# EasyEDA Pro project Connector_FPC_V2025.12.eprj

# Schematic Schematic1
Board Name: Board1; Create Date: 2025-12-14; Page Name: P1; Project Name: Connector_FPC_V2025.12; Schematic Name: Schematic1; Update Date: 2025-12-26; Company: EasyEDA.com; Page Size: A4; Version: V1.0
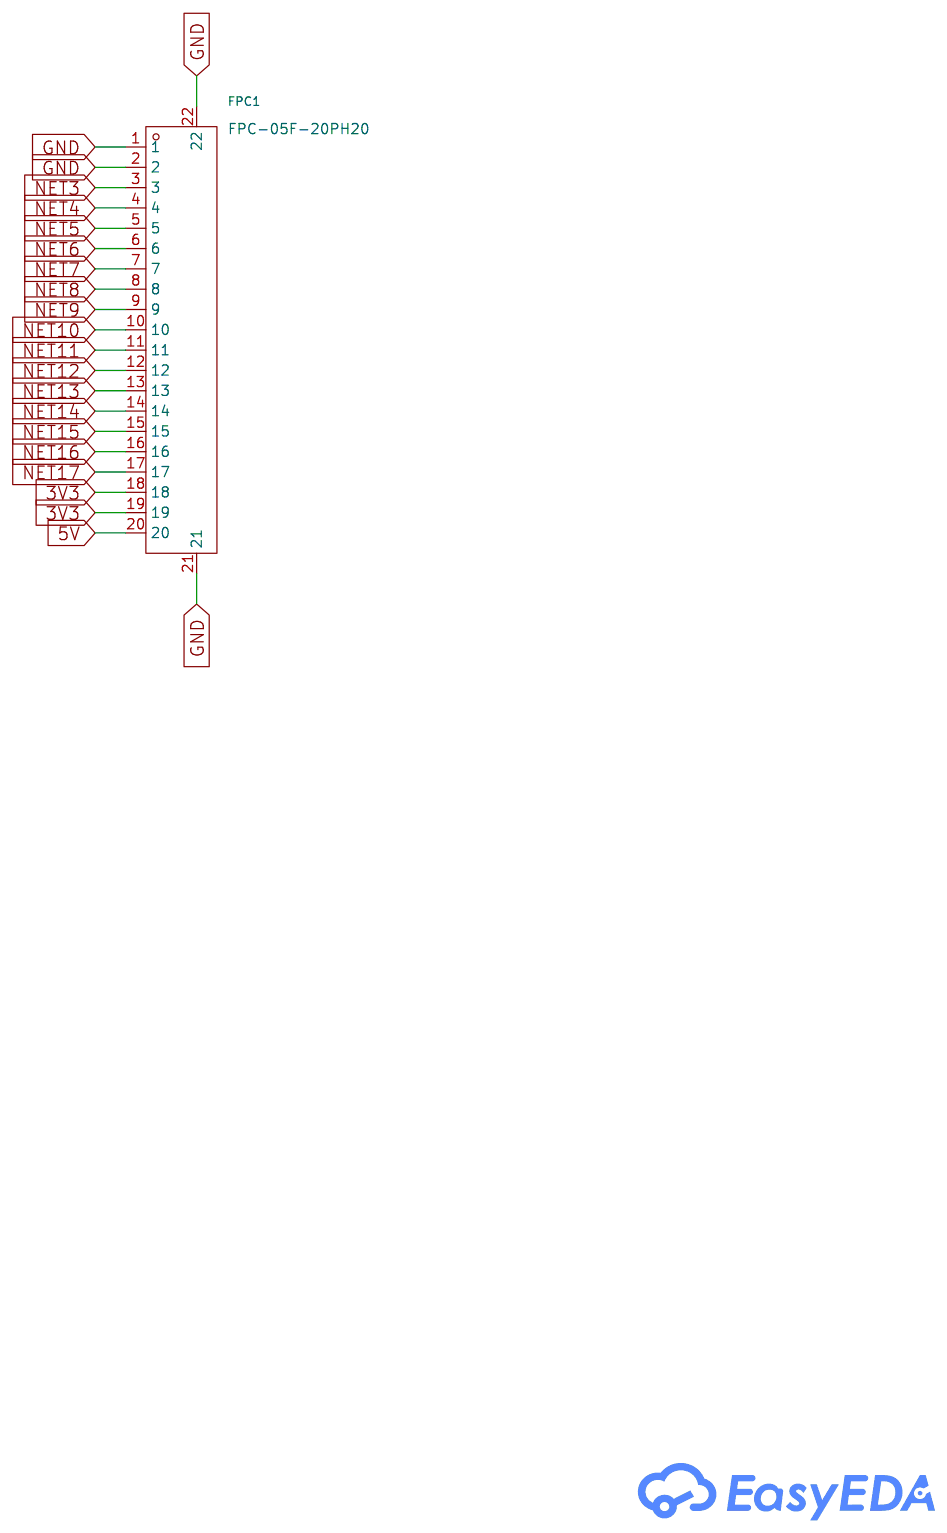
[diagram p0: schematic sheet]

## Parts
FPC1  FPC-05F-20PH20  [FPC-SMD_20P-P0.50_XUNPU_FPC-05F-20PH20]

## Library data of the parts
FPC1 = FPC-05F-20PH20: Locking Feature:Hinged Lid Contact Type:Surface Mount Number of Contacts:20P Pitch:0.5mm Mounting Type:Bottom Contact FFC, FCB Thickness:0.3mm FFC, FCB Thickness:0.3mm Height Above Board:2mm Contact Material:Phosphor Bronze Contact Plating:Tin Operating T; LCSC Part Name: 翻盖式 卧贴 P数:20P 间距:0.5mm; Supplier Part: C2856803; Manufacturer: XUNPU(讯普); Supplier Footprint: SMD,P=0.5mm,卧贴; JLCPCB Part Class: 扩展库; Datasheet: https://item.szlcsc.com/datasheet/FPC-05F-20PH20/3056901.html; Supplier: LCSC; Locking Feature: Hinged Lid; Contact Type: Surface Mount; Number of Contacts: 20P; Pitch: 0.5mm; Mounting Type: Bottom Contact; FFC, FCB Thickness: 0.3mm; Height Above Board: 2mm; Contact Material: Phosphor Bronze; Contact Plating: Tin; Operating Temperature: -25℃~+85℃; Rated Voltage (Max): 50V; Current Rating (Max): 500mA

## Nets
3V3: FPC1.18 FPC1.19
5V: FPC1.20
GND: FPC1.1 FPC1.2 FPC1.21 FPC1.22
NET3: FPC1.3
NET4: FPC1.4
NET5: FPC1.5
NET6: FPC1.6
NET7: FPC1.7
NET8: FPC1.8
NET9: FPC1.9
NET10: FPC1.10
NET11: FPC1.11
NET12: FPC1.12
NET13: FPC1.13
NET14: FPC1.14
NET15: FPC1.15
NET16: FPC1.16
NET17: FPC1.17

# Board PCB1
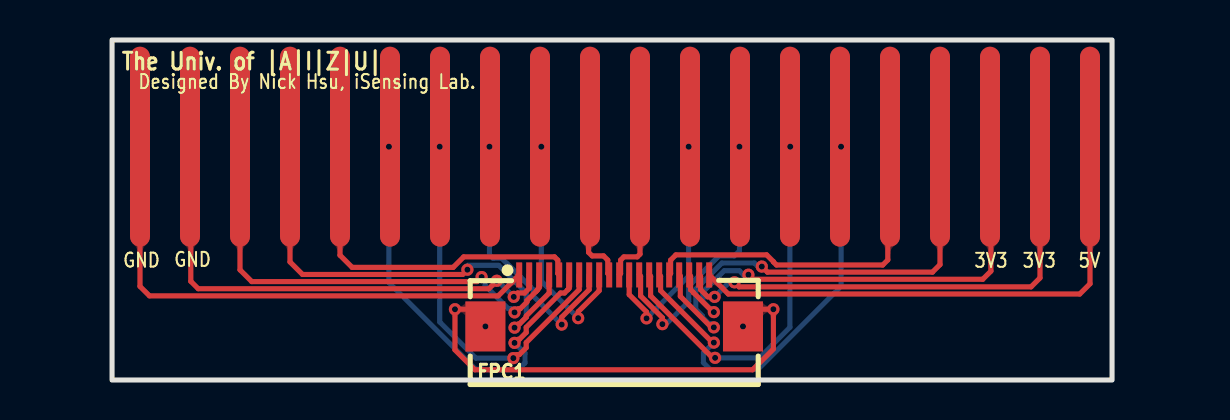
[diagram p1: board, top side]
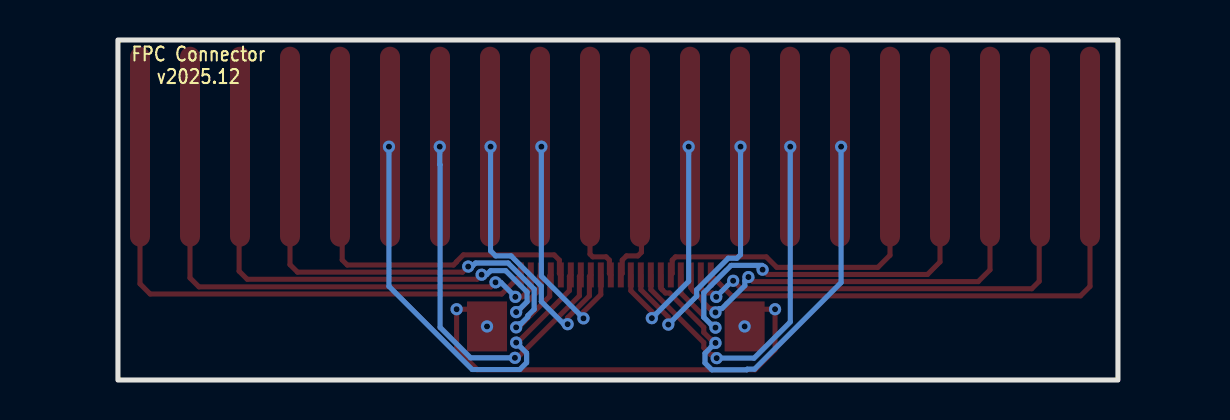
[diagram p2: board, bottom side, seen from below]

Outline 50 x 17 mm; copper layers: Top Layer, Bottom Layer. Coordinates in mm from the lower left corner of the outline.
Outline path: rectangle 0,17 50,0
Stack: Top Layer 0.035mm / Dielectric1 1.51mm FR4 er 4.5 / Bottom Layer 0.035mm

## Design rules (mm)
template: JLCPCB Capability(Two Layers Board)
spacing copperThickness1oz (default): track to track 0.102, other pairs 0.152 to 0.3
spacing copperThickness2oz: track to track 0.203, other pairs 0.152 to 0.3
track width copperThickness1oz (default): min 0.127, default 0.254, max 2.54
track width copperThickness2oz: min 0.203, default 0.254, max 2.54
differential pair differentialPair (default): width min 0.127, default 0.254, max 2.54; gap min 0.152, default 0.152
via viaSize (default): diameter min 0.5, default 0.61, max 10; hole min 0.3, default 0.305, max 6.3

## Placement (name value [footprint] x y rotation side)
FPC1  FPC-05F-20PH20  [FPC-SMD_20P-P0.50_XUNPU_FPC-05F-20PH20]  25.11 3.97 0 top
NOREF  -  [Pad_e6]  8.9 11.67 0 top
NOREF#2  -  [Pad_e3]  41.4 11.67 0 top
NOREF#3  -  [Pad_e4]  3.9 11.67 0 top
NOREF#4  -  [Pad_e21]  48.9 11.67 0 top
NOREF#5  -  [Pad_e18]  43.9 11.67 0 top
NOREF#6  -  [Pad_e17]  36.4 11.67 0 top
NOREF#7  -  [Pad_e12]  23.9 11.67 0 top
NOREF#8  -  [Pad_e15]  31.4 11.67 0 top
NOREF#9  -  [Pad_e14]  28.9 11.67 0 top
NOREF#10  -  [Pad_e10]  18.9 11.67 0 top
NOREF#11  -  [Pad_e8]  13.9 11.67 0 top
NOREF#12  -  [Pad_e7]  11.4 11.67 0 top
NOREF#13  -  [Pad_e1]  1.4 11.67 0 top
NOREF#14  -  [Pad_e11]  21.4 11.67 0 top
NOREF#15  -  [Pad_e13]  26.4 11.67 0 top
NOREF#16  -  [Pad_e2]  38.9 11.67 0 top
NOREF#17  -  [Pad_e16]  33.9 11.67 0 top
NOREF#18  -  [Pad_e19]  46.4 11.67 0 top
NOREF#19  -  [Pad_e5]  6.4 11.67 0 top
NOREF#20  -  [Pad_e9]  16.4 11.67 0 top

## Footprints (pads in the part's own frame, mm; a bottom-side part is the same pattern mirrored in y, then rotated)
FPC-SMD_20P-P0.50_XUNPU_FPC-05F-20PH20
  rect 0.3x1.25 smd: 1(-4.75,1.288) 2(-4.25,1.288) 3(-3.75,1.288) 4(-3.25,1.288) 5(-2.75,1.288) 6(-2.25,1.288) 7(-1.75,1.288) 8(-1.25,1.288) 9(-0.75,1.288) 10(-0.25,1.288) 11(0.25,1.288) 12(0.75,1.288) 13(1.25,1.288) 14(1.75,1.288) 15(2.25,1.288) 16(2.75,1.288) 17(3.25,1.288) 18(3.75,1.288) 19(4.25,1.288) 20(4.75,1.288)
  rect 2x2.5 smd: 21(6.44,-1.288) 22(-6.44,-1.288)
Pad_e1
  rrect 1x10 smd: 1(0,0)
Pad_e2
  rrect 1x10 smd: 15(0,0)
Pad_e3
  rrect 1x10 smd: 15(0,0)
Pad_e4
  rrect 1x10 smd: 2(0,0)
Pad_e5
  rrect 1x10 smd: 3(0,0)
Pad_e6
  rrect 1x10 smd: 4(0,0)
Pad_e7
  rrect 1x10 smd: 5(0,0)
Pad_e8
  rrect 1x10 smd: 6(0,0)
Pad_e9
  rrect 1x10 smd: 7(0,0)
Pad_e10
  rrect 1x10 smd: 8(0,0)
Pad_e11
  rrect 1x10 smd: 9(0,0)
Pad_e12
  rrect 1x10 smd: 10(0,0)
Pad_e13
  rrect 1x10 smd: 11(0,0)
Pad_e14
  rrect 1x10 smd: 12(0,0)
Pad_e15
  rrect 1x10 smd: 13(0,0)
Pad_e16
  rrect 1x10 smd: 14(0,0)
Pad_e17
  rrect 1x10 smd: 15(0,0)
Pad_e18
  rrect 1x10 smd: 15(0,0)
Pad_e19
  rrect 1x10 smd: 15(0,0)
Pad_e21
  rrect 1x10 smd: 15(0,0)

## Nets
3V3: FPC1.18 FPC1.19 NOREF#5.15 NOREF#18.15
5V: FPC1.20 NOREF#4.15
GND: FPC1.1 FPC1.2 FPC1.21 FPC1.22 NOREF#3.2 NOREF#13.1
NET3: FPC1.3 NOREF#19.3
NET4: FPC1.4 NOREF.4
NET5: FPC1.5 NOREF#12.5
NET6: FPC1.6 NOREF#11.6
NET7: FPC1.7 NOREF#20.7
NET8: FPC1.8 NOREF#10.8
NET9: FPC1.9 NOREF#14.9
NET10: FPC1.10 NOREF#7.10
NET11: FPC1.11 NOREF#15.11
NET12: FPC1.12 NOREF#9.12
NET13: FPC1.13 NOREF#8.13
NET14: FPC1.14 NOREF#17.14
NET15: FPC1.15 NOREF#6.15
NET16: FPC1.16 NOREF#16.15
NET17: FPC1.17 NOREF#2.15

## Via types
v1: diameter 0.61, hole 0.305, Top Layer to Bottom Layer, 32 vias

## Routing (per net, layer and track width the routed paths; a pad name or vN(x,y) marks a point on that pad's centre or on a via; arc(x,y) is an arc through that point)
3V3: length 50.1
  Top Layer w0.254: v1(30.13,4.16) 29.78,4.16 29.43,4.51 29.43,5.18 FPC1.19 ; FPC1.18 28.93,5.18 28.93,4.51 29.07,4.37 29.07,4.37 30.04,3.39 v1(30.09,3.39) ; v1(31.82,5.27) 32.04,5.04 43.54,5.04 43.94,5.44 43.94,11.62 NOREF#5.15 ; NOREF#18.15 46.4,5.1 45.95,4.66 31.35,4.66 v1(31.12,4.88)
  Bottom Layer w0.254: v1(30.13,4.16) 30.86,4.88 v1(31.12,4.88) ; v1(31.82,5.27) 31.57,5.27 31.36,5.47 30.61,5.47 29.54,4.4 29.54,3.91 29.89,3.57 29.91,3.57 v1(30.09,3.39)
5V: length 26.5
  Top Layer w0.254: NOREF#4.15 48.9,4.81 48.39,4.3 30.81,4.3 FPC1.20
GND: length 76.4
  Top Layer w0.254: NOREF#3.2 3.94,11.63 3.94,4.94 4.31,4.56 18.84,4.56 v1(19.24,4.96) ; NOREF#13.1 1.4,4.68 1.87,4.21 19.31,4.21 FPC1.1 ; v1(31.55,2.68) 32.41,3.54 v1(33.07,3.54) 33.07,1.55 32.02,0.51 18.14,0.51 17.14,1.51 v1(17.14,3.54) 17.81,3.54 v1(18.67,2.68) ; FPC1.2 20.86,4.58 20.62,4.35 20.28,4.35 v1(20.08,4.16) ; 3.82,11.69 3.94,11.69
  Bottom Layer w0.254: v1(20.08,4.16) 19.28,4.96 v1(19.24,4.96)
NET3: length 23.5
  Top Layer w0.254: v1(18.48,5.15) 18.25,4.92 6.98,4.92 6.4,5.51 NOREF#19.3 ; v1(20.12,3.38) 20.3,3.56 20.4,3.56 20.75,3.9 20.75,3.97 21.21,4.44 21.21,4.44 21.29,4.51 21.29,4.54 21.36,4.61 FPC1.3
  Bottom Layer w0.254: v1(18.48,5.15) 18.65,4.97 18.65,4.72 19.8,3.57 19.93,3.57 v1(20.12,3.38)
NET4: length 24.1
  Top Layer w0.254: NOREF.4 8.9,5.9 9.52,5.28 17.53,5.28 v1(17.77,5.52) ; FPC1.4 21.86,4.35 20.71,3.2 20.71,3.14 20.37,2.8 20.3,2.8 v1(20.12,2.62)
  Bottom Layer w0.254: v1(17.77,5.52) 17.77,5.71 17.79,5.73 19.34,5.73 20.71,4.36 20.71,3.14 20.19,2.62 v1(20.12,2.62)
NET5: length 17.6
  Top Layer w0.254: FPC1.5 22.29,5.32 22.29,5.99 22.12,6.16 17.58,6.16 17.06,5.63 12,5.63 11.4,6.24 NOREF#12.5
NET6: length 21.5
  Top Layer w0.254: v1(13.84,11.67) NOREF#11.6 ; v1(20.12,1.86) 20.3,2.03 20.37,2.03 20.71,2.38 20.71,2.63 22.42,4.35 22.62,4.35 22.79,4.51 22.79,4.52 22.86,4.59 FPC1.6
  Bottom Layer w0.254: v1(13.84,11.67) 13.84,4.87 18.17,0.54 18.53,0.54 18.56,0.51 20.3,0.51 20.65,0.85 20.65,1.34 20.3,1.68 20.3,1.68 v1(20.12,1.86)
NET7: length 18.8
  Top Layer w0.254: FPC1.7 23.36,4.52 20.71,1.87 20.71,1.61 20.37,1.27 20.24,1.27 v1(20.06,1.09) ; v1(16.38,11.67) NOREF#20.7
  Bottom Layer w0.254: v1(20.06,1.09) 18.19,1.09 16.38,2.9 v1(16.38,11.67)
NET8: length 13.7
  Top Layer w0.254: v1(18.87,11.67) NOREF#10.8 ; 18.84,7.75 18.82,7.77 ; FPC1.8 23.86,4.52 22.48,3.14 v1(22.48,2.77)
  Bottom Layer w0.254: v1(18.87,11.67) 18.87,6.27 19.05,6.09 19.48,6.09 21.06,4.51 21.06,4.19 v1(22.48,2.77)
NET9: length 11.9
  Top Layer w0.254: v1(23.31,3.09) 23.31,3.41 24.36,4.47 FPC1.9
  Bottom Layer w0.254: v1(21.46,11.67) 21.46,4.94 v1(23.31,3.09)
NET10: length 6.6
  Top Layer w0.254: FPC1.10 24.79,5.32 24.79,5.99 24.57,6.2 24,6.2 23.82,6.38 23.82,11.09
NET11: length 7.2
  Top Layer w0.254: FPC1.11 25.43,5.32 25.43,5.99 25.59,6.16 26.26,6.16 26.4,6.29 NOREF#15.11
NET12: length 12.1
  Top Layer w0.254: v1(26.72,3.08) 26.72,3.4 25.86,4.27 FPC1.12 ; 28.9,11.63 28.9,11.57 ; v1(28.83,11.67) NOREF#9.12
  Bottom Layer w0.254: v1(28.83,11.67) 28.83,5.19 26.72,3.09 v1(26.72,3.08)
NET13: length 14
  Top Layer w0.254: v1(27.52,2.79) 27.52,3.11 26.43,4.2 26.43,5.18 FPC1.13 ; v1(31.37,11.67) NOREF#8.13
  Bottom Layer w0.254: v1(31.37,11.67) 31.37,6.46 31.11,6.2 30.34,6.2 28.83,4.69 28.83,3.92 27.7,2.79 v1(27.52,2.79)
NET14: length 19.1
  Top Layer w0.254: 33.94,11.61 33.96,11.59 ; v1(33.91,11.67) NOREF#17.14 ; FPC1.14 26.93,5.18 26.93,4.21 30.03,1.11 v1(30.15,1.11) ; 33.88,11.61 33.9,11.61
  Bottom Layer w0.254: v1(30.15,1.11) 32.37,1.11 33.89,2.63 33.89,10.76 33.91,10.78 v1(33.91,11.67)
NET15: length 21.6
  Top Layer w0.254: v1(30.09,1.87) 30.03,1.87 27.43,4.47 27.43,5.18 FPC1.15 ; v1(36.45,11.67) NOREF#6.15
  Bottom Layer w0.254: v1(36.45,11.67) 36.45,4.69 32.29,0.52 29.91,0.52 29.57,0.87 29.57,1.35 30.09,1.87
NET16: length 17.8
  Top Layer w0.254: FPC1.16 27.93,5.32 27.93,5.99 28.19,6.26 32.73,6.26 33.07,5.91 33.07,5.9 33.22,5.75 38.53,5.75 38.79,6 38.79,11.56 NOREF#16.15
NET17: length 24.7
  Top Layer w0.254: FPC1.17 28.41,5.2 28.41,4.19 29.97,2.63 v1(30.09,2.63) ; NOREF#2.15 41.4,5.77 41.02,5.39 32.77,5.39 v1(32.49,5.67)
  Bottom Layer w0.254: v1(32.49,5.67) 32.3,5.67 32.12,5.85 30.49,5.85 29.19,4.55 29.19,3.53 29.51,3.22 29.51,3.15 29.85,2.81 29.91,2.81 v1(30.09,2.63)

## Copper pours and planes (outline as drawn; the poured copper is in the pictures)
3V3 on Top Layer: 43.9,6.2 46.4,6.2 46.4,4.66 43.9,4.66
GND on Top Layer: -2.41,6.33 -2.41,-2.43 -1.65,-3.19 51.44,-3.19 54.74,0.11 54.74,6.08 54.99,6.33
GND on Top Layer: 0.89,6.33 5.21,6.33 5.21,3.66 0.89,3.66

Small or netless copper shapes (teardrops, artwork), in the pictures only: 27 on Top Layer, 18 on Bottom Layer

## Text on the board
Bottom Silkscreen Layer: FPC Connector / v2025.12
Top Silkscreen Layer: GND | 3V3 | 5V | Designed By Nick Hsu, iSensing Lab. | The Univ. of |A|I|Z|U|
